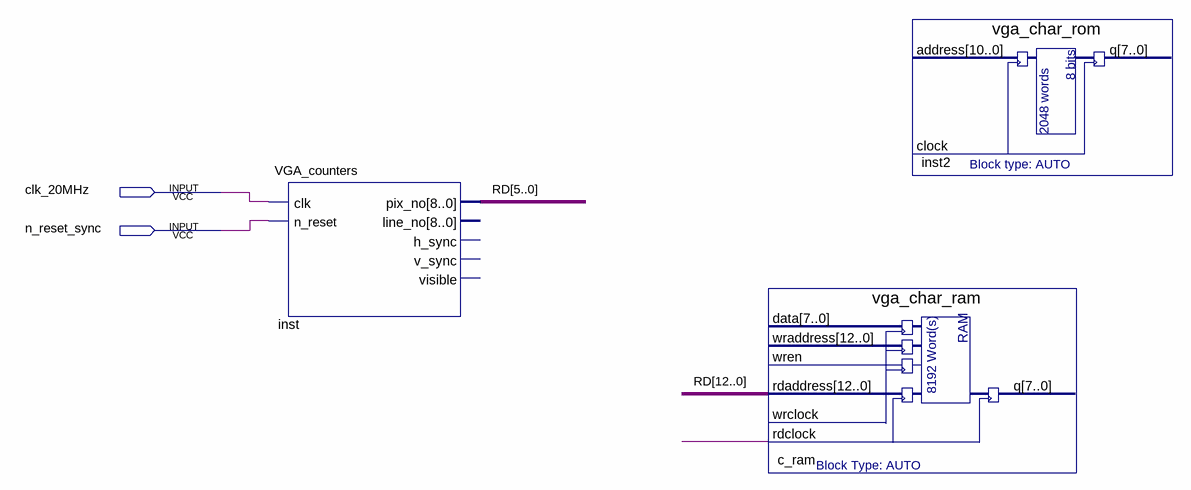
[diagram p0: schematic sheet]
// Quartus schematic VGA.bdf as structural Verilog: 3 symbols, 2 pins
module VGA (
  input  clk_20MHz,
  input  n_reset_sync
);

  wire undriven;
  wire [12:0] RD;

  VGA_counters inst (
    .clk(clk_20MHz), .n_reset(n_reset_sync), .pix_no(RD[5:0]));  // open: line_no, h_sync, v_sync, visible
  vga_char_ram c_ram (.rdaddress(RD), .rdclock(undriven));  // open: data, wraddress, wren, wrclock, q
  vga_char_rom inst2 ();  // open: address, clock, q
endmodule
